# EAGLE design ATTiny2313_ISP (EAGLE 6.5.0)
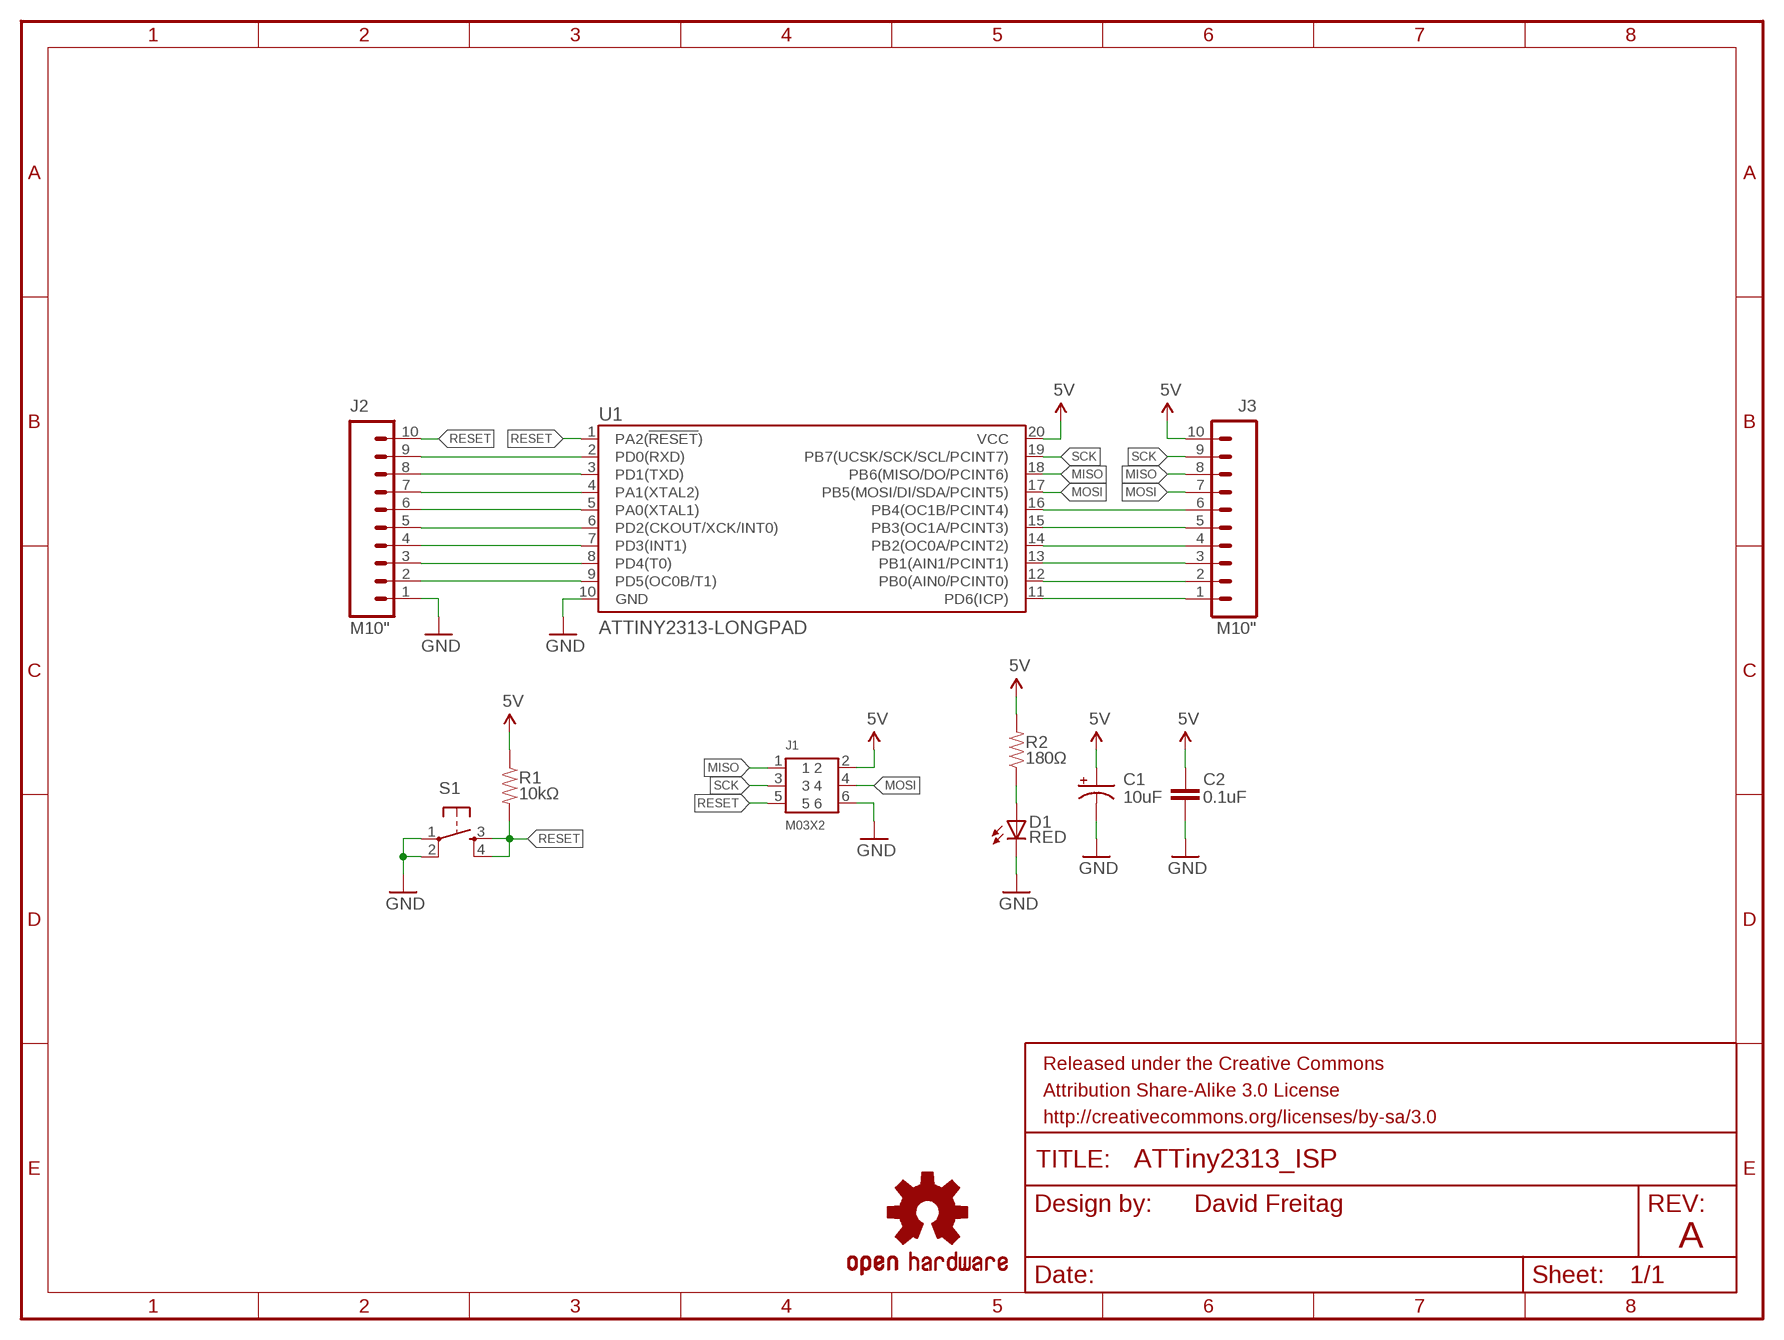
[diagram p0: schematic, sheet 1]

## Parts
C1  10uF  CAP_POLPTH2  [CPOL-RADIAL-10UF-25V]
C2  0.1uF  CAPEZ  [CAP-PTH-SMALLEZ]
D1  RED  LED3MM  [LED3MM]
FRAME1  FRAME-LETTER  [CREATIVE_COMMONS]
J1  M03X2  [M03X2]
J2  M10"  [1X10]
J3  M10"  [1X10]
LOGO1  OSHW-LOGOM  [OSHW-LOGO-M]
R1  10kΩ  RESISTORPTH-1/8W  [AXIAL-0.2]
R2  180Ω  RESISTORPTH-1/8W  [AXIAL-0.2]
S1  TAC_SWITCHPTH  [TACTILE-PTH]
U1  ATTINY2313-LONGPAD  [DIP20-LONGPAD]

## Nets
5V: C1.1(+) C2.1 J1.2 J3.10 R1.P$1 R2.P$2 U1.20(VCC)
GND: C1.2(-) C2.2 D1.K(C) J1.6 J2.1 S1.1 S1.2 U1.10(GND)
MISO: J1.1 J3.8 U1.18(PB6(MISO/DO/PCINT6))
MOSI: J1.4 J3.7 U1.17(PB5(MOSI/DI/SDA/PCINT5))
N$1: D1.A R2.P$1
N$2: J2.9 U1.2(PD0(RXD))
N$3: J2.8 U1.3(PD1(TXD))
N$4: J2.7 U1.4(PA1(XTAL2))
N$5: J2.6 U1.5(PA0(XTAL1))
N$6: J2.5 U1.6(PD2(CKOUT/XCK/INT0))
N$7: J2.4 U1.7(PD3(INT1))
N$8: J2.3 U1.8(PD4(T0))
N$9: J2.2 U1.9(PD5(OC0B/T1))
N$10: J3.6 U1.16(PB4(OC1B/PCINT4))
N$11: J3.5 U1.15(PB3(OC1A/PCINT3))
N$12: J3.4 U1.14(PB2(OC0A/PCINT2))
N$13: J3.3 U1.13(PB1(AIN1/PCINT1))
N$14: J3.2 U1.12(PB0(AIN0/PCINT0))
N$15: J3.1 U1.11(PD6(ICP))
RESET: J1.5 J2.10 R1.P$2 S1.3 S1.4 U1.1(PA2(!RESET!))
SCK: J1.3 J3.9 U1.19(PB7(UCSK/SCK/SCL/PCINT7))

## Notes on the sheet
- David Freitag
- A

## Library data of the parts
C1 = SparkFun-Passives:CAP_POL: Capacitor Polarized These are standard SMD and PTH capacitors. Normally 10uF, 47uF, and 100uF in electrolytic and tantalum varieties. Always verify the external diameter of the through hole cap, it varies with capacity, voltage, and manufacturer. The EIA devices should be standard.
C2 = SparkFun-Passives:CAP: Capacitor Standard 0603 ceramic capacitor, and 0.1" leaded capacitor.
D1 = SparkFun-LED:LED: LEDs Standard schematic elements and footprints for 5mm, 3mm, 1206, and 0603 sized LEDs. 5mm - Spark Fun Electronics SKU : COM-00529 (and others)
FRAME1 = SparkFun-Aesthetics:FRAME-LETTER: Schematic Frame Standard 8.5x11 US Letter frame
J1 = Connectors:M03X2
J2 J3 = SparkFun-Connectors:M10: Header 10 Standard 10-pin 0.1" header. Use with straight break away headers (SKU : PRT-00116), right angle break away headers (PRT-00553), swiss pins (PRT-00743), machine pins (PRT-00117), and female headers (PRT-00115).
LOGO1 = SparkFun-Aesthetics:OSHW-LOGO: Open Source Hardware Logo This logo indicates the piece of hardware it is found on incorporates a OSHW license and/or adheres to the definition of open source hardware found here: http://freedomdefined.org/OSHW
R1 R2 = SparkFun-Passives:RESISTOR: Resistor Basic schematic elements and footprints for 0603, 1206, and PTH resistors.
S1 = SparkFun-Electromechanical:TAC_SWITCH: Momentary Switch Button commonly used for reset or general input. Spark Fun Electronics SKU : COM-00097 SMT- SWCH-08247
U1 = Atmel:ATTINY2313

## Board
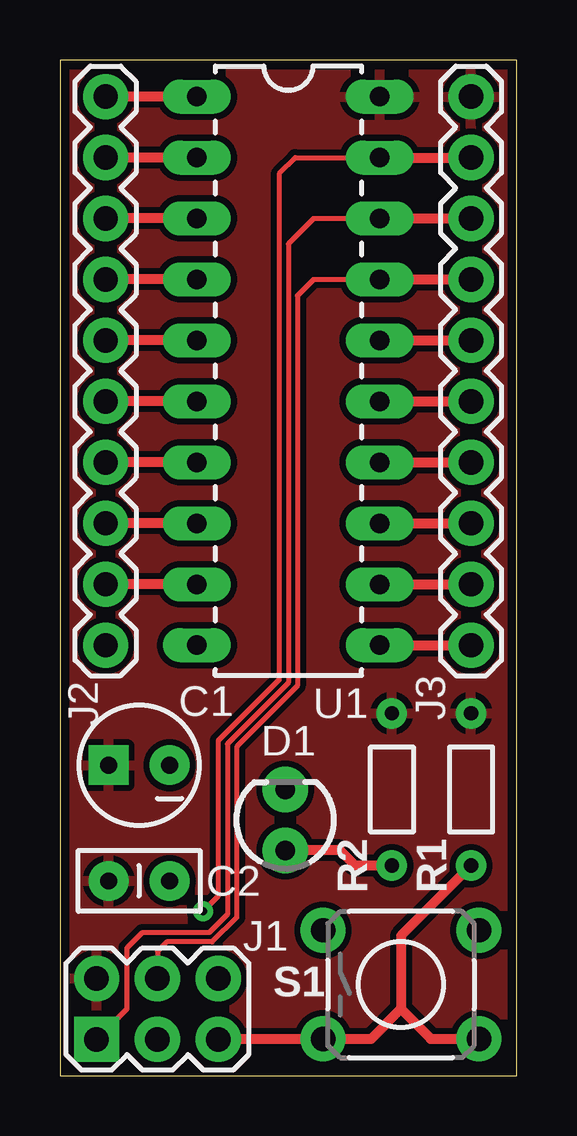
[diagram p1: board, top side]
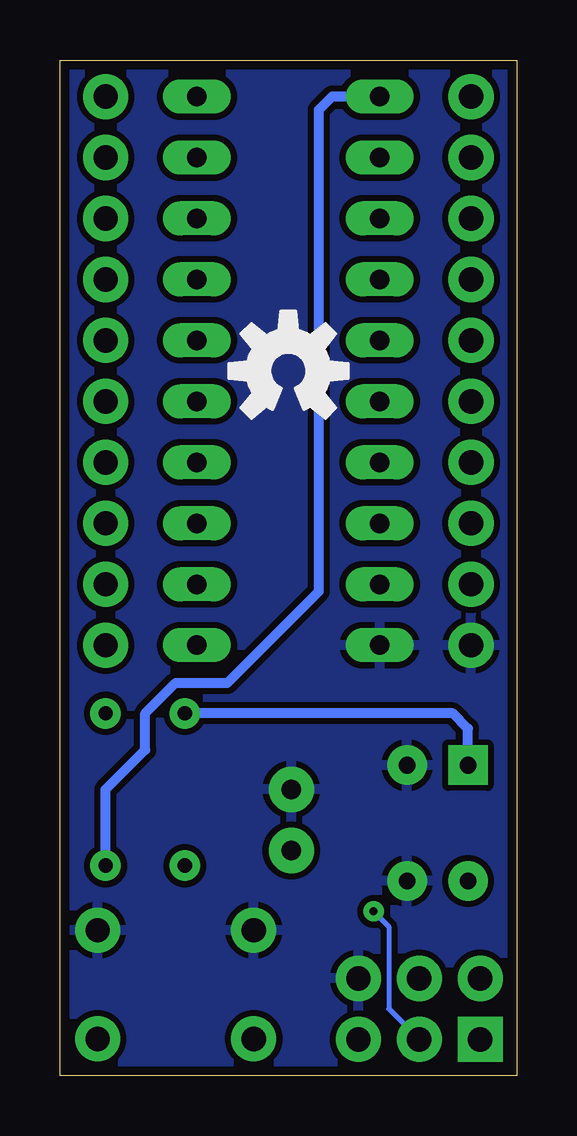
[diagram p2: board, bottom side, seen from below]

Size 19.05 x 42.33 mm. Coordinates in mm from the lower left corner, seen from the top.
Outline: 0,0 19.05,0 19.05,42.33 0,42.33 0,0
Copper layers (1*16): Top 0.0356mm / dielectric 1.5011mm / Bottom 0.0356mm
Design rules "LaenPCBOrder": minimum track width 6mil, minimum drill 13mil, track to track 6mil, track to pad 6mil, pad to pad 6mil, via to via 6mil, smd to smd 6mil, copper to edge 15mil, drill to drill 6mil, minimum pad ring 12mil, minimum via ring 10mil, stop-mask expansion 4mil, vias tented up to drill 15mil, thermal gap 10mil

### Footprints (pad centres in the part's own frame; a part is rotated, then mirrored left to right if it is on the bottom)
CPOL-RADIAL-10UF-25V = drill 0.7 pad 1.651 square: 1 1.27,0 | drill 0.7 pad 1.651: 2 -1.27,0
CAP-PTH-SMALLEZ = drill 0.7 pad 1.651: 1 0,0; 2 2.54,0
LED3MM = drill 0.813 pad 1.88: A -1.27,0; K 1.27,0
M03X2 = drill 1.016 pad 1.88 square: 1 -2.54,-1.27 | drill 1.016 pad 1.88: 2 -2.54,1.27; 3 0,-1.27; 4 0,1.27; 5 2.54,-1.27; 6 2.54,1.27
1X10 = drill 1.016 pad 1.88: 1 0,0; 2 2.54,0; 3 5.08,0; 4 7.62,0; 5 10.16,0; 6 12.7,0; 7 15.24,0; 8 17.78,0; 9 20.32,0; 10 22.86,0
AXIAL-0.2 = drill 0.6 pad 1.27: P$1 -3.175,0; P$2 3.175,0
TACTILE-PTH = drill 1.016 pad 1.88: 1 -3.251,2.261; 2 3.251,2.261; 3 -3.251,-2.261; 4 3.251,-2.261
DIP20-LONGPAD = drill 0.813 long: 1 -3.81,10.16; 2 -3.81,7.62; 3 -3.81,5.08; 4 -3.81,2.54; 5 -3.81,0; 6 -3.81,-2.54; 7 -3.81,-5.08; 8 -3.81,-7.62; 9 -3.81,-10.16; 10 -3.81,-12.7; 11 3.81,-12.7; 12 3.81,-10.16; 13 3.81,-7.62; 14 3.81,-5.08; 15 3.81,-2.54; 16 3.81,0; 17 3.81,2.54; 18 3.81,5.08; 19 3.81,7.62; 20 3.81,10.16

### Placement (x,y rotation side)
C1  3.3,12.95 180 top
C2  2.03,8.13 0 top
D1  9.4,10.67 90 top
FRAME1  -23.5,-8.89 0 top  (outside the outline)
J1  4.06,2.79 0 top
J2  1.91,17.95 90 top
J3  17.14,17.95 90 top
LOGO1  9.53,29.38 0 bottom
R1  17.14,11.94 270 top
R2  13.84,11.94 90 top
S1  14.22,3.81 0 top
U1  9.53,30.65 0 top

### Tracks (layer width: path | path; a pad name or v marks a point on that pad's centre or on a via)
5V
  Bottom 0.406: C1.1 2.03,14.48 2.67,15.11 R2.P$2
  pour Top (isolate 0.254): 0,42.33 19.05,42.33 19.05,0 0,0
GND
  pour Bottom (isolate 0.254): 0,42.33 19.05,42.33 19.05,0 0,0
MISO
  Top 0.203: J1.1 2.79,2.79 2.79,5.33 3.43,5.97 6.22,5.97 6.99,6.73 6.99,13.84 9.53,16.38 9.53,34.67 10.58,35.73 U1.18
  Top 0.406: U1.18 J3.8
MOSI
  Top 0.203: J1.4 4.06,5.21 4.45,5.59 6.35,5.59 7.37,6.6 7.37,13.72 9.91,16.26 9.91,32.51 10.58,33.19 U1.17
  Top 0.406: U1.17 J3.7
N$1
  Top 0.406: R2.P$1 12.32,8.76 11.68,9.4 D1.A
N$2
  Top 0.406: U1.2 J2.9
N$3
  Top 0.406: U1.3 J2.8
N$4
  Top 0.406: U1.4 J2.7
N$5
  Top 0.406: U1.5 J2.6
N$6
  Top 0.406: U1.6 J2.5
N$7
  Top 0.406: U1.7 J2.4
N$8
  Top 0.406: U1.8 J2.3
N$9
  Top 0.406: U1.9 J2.2
N$10
  Top 0.406: U1.16 J3.6
N$11
  Top 0.406: U1.15 J3.5
N$12
  Top 0.406: U1.14 J3.4
N$13
  Top 0.406: U1.13 J3.3
N$14
  Top 0.406: U1.12 J3.2
N$15
  Top 0.406: U1.11 J3.1
RESET
  Top 0.406: R1.P$2 14.22,5.84 14.22,2.79 | 14.22,2.79 15.47,1.55 S1.4 | 14.22,2.79 12.98,1.55 S1.3 10.95,1.52 J1.5 | U1.1 J2.10
  Bottom 0.406: R1.P$2 17.14,11.94 15.49,13.59 15.49,15.11 14.22,16.38 12.06,16.38 8.26,20.19 8.26,40.26 7.71,40.81 U1.1
SCK  (via drill 0.33)
  Top 0.203: v5.97,6.86 6.6,7.49 6.6,13.97 9.14,16.51 9.14,37.59 9.82,38.27 U1.19
  Top 0.406: U1.19 J3.9
  Bottom 0.203: v5.97,6.86 5.33,6.22 5.33,2.79 J1.3

### Text on the board
Document: (!RESET!/dW) PA2 | 1 | 20 | VCC | (RXD) PD0 | 2 | 19 | PB7 (UCSK/SCL/SCK/PCINT7) | (TXD) PD1 | 3 | 18 | PB6 (MISO/DO/PCINT6) | (XTAL2) PA1 | 4 | 17 | PB5 (MOSI/DI/SDA/PCINT5) | (XTAL1) PA0 | 5 | 16 | PB4 (OC1B/PCINT4) | (CKOUT/XCK/INT0) PD2 | 6 | 15 | PB3 (OC1A/PCINT3) | (INT1) PD3 | 7 | 14 | PB2 (OC0A/PCINT2) | (T0) PD4 | 8 | 13 | PB1 (AIN1/PCINT1) | (OC0B/T1) PD5 | 9 | 12 | PB0 (AIN0/PCINT0) | GND | 10 | 11 | PD6 (ICP) | David Freitag